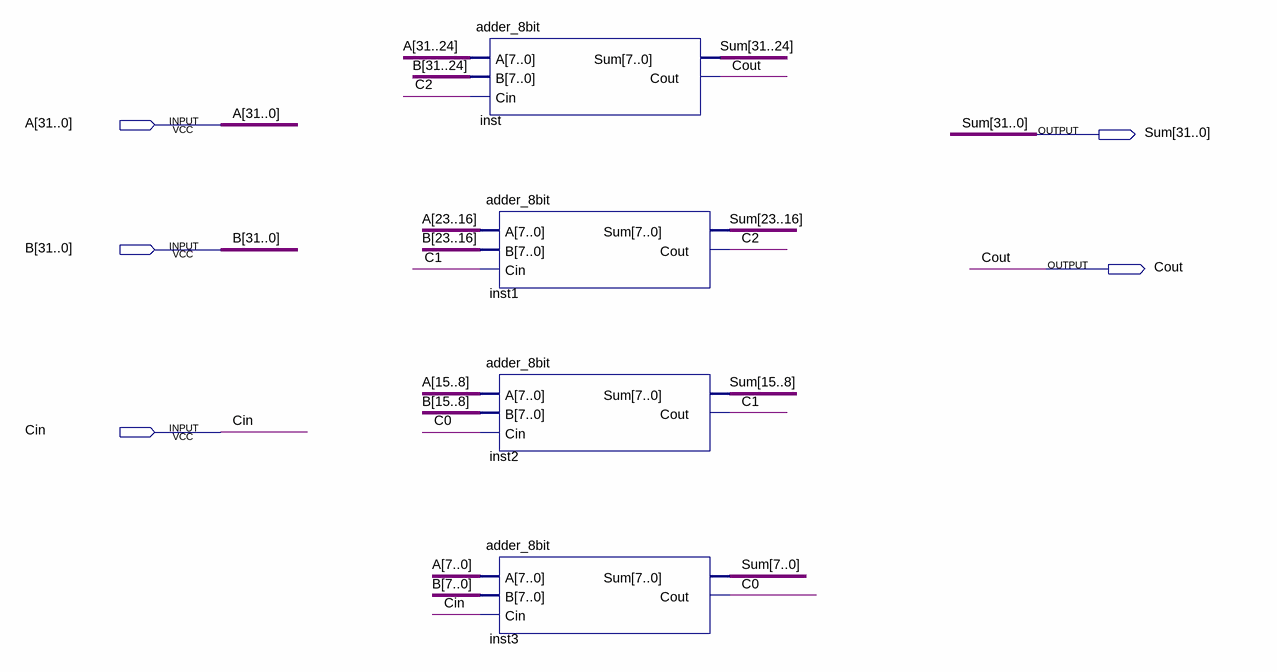
[diagram p0: schematic sheet]
// Quartus schematic Adder_32bit.bdf as structural Verilog: 4 symbols, 5 pins
module Adder_32bit (
  input  [31:0] A,
  input  [31:0] B,
  input  Cin,
  output [31:0] Sum,
  output Cout
);

  wire C0, C1, C2;

  adder_8bit inst (.A(A[31:24]), .B(B[31:24]), .Cin(C2), .Sum(Sum[31:24]), .Cout(Cout));
  adder_8bit inst1 (.A(A[23:16]), .B(B[23:16]), .Cin(C1), .Sum(Sum[23:16]), .Cout(C2));
  adder_8bit inst2 (.A(A[15:8]), .B(B[15:8]), .Cin(C0), .Sum(Sum[15:8]), .Cout(C1));
  adder_8bit inst3 (.A(A[7:0]), .B(B[7:0]), .Cin(Cin), .Sum(Sum[7:0]), .Cout(C0));
endmodule
